# Altium schematic sheet ESQUEMATICOS PROYECTO 1 JAVIER MEDINA (PROGRA MICROS).SchDoc
size Letter; Organization: Altium Limited; Address1: L3, 12a Rodborough Rd; Address2: Frenchs Forest; Address3: NSW; Address4: Australia 2086; SPICEModelCacheNXRQJJJB: <root> / <DocumentId>NXRQJJJB</DocumentId> / <CacheFrame Number="0"> / <Model Name="2n3904" Kind="MDL"> / <Text>*2N3904 / *Si 310mW  40V 200mA 300MHz pkg:TO-92B 1,2,3 / .MODEL 2N3904 NPN(IS=1.4E-14 BF=300 VAF=100 IKF=0.025 ISE=3E-13 / + BR=7.5 RC=2.4 CJE=4.5E-12 TF=4E-10 CJC=3.5E-12 TR=2.1E-8 XTB=1.5 KF=9E-16 )</Text> / </Model> / </CacheFrame> / </root>
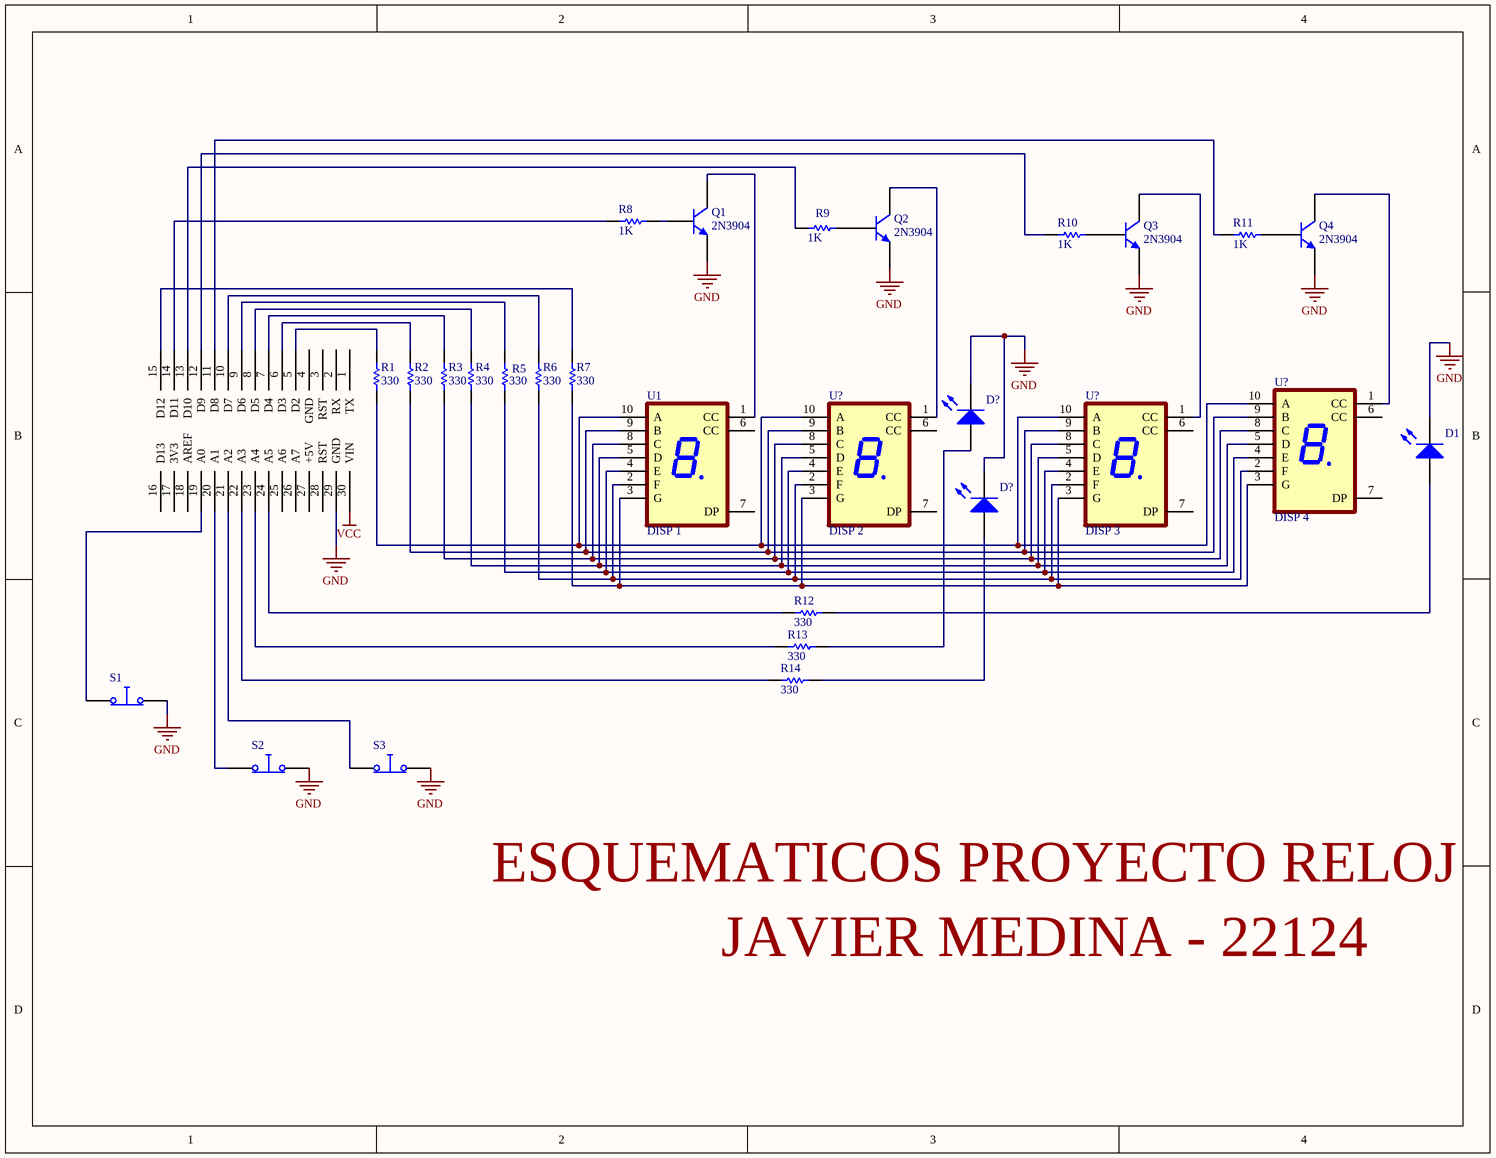
[diagram p0: ESQUEMATICOS PROYECTO 1 JAVIER MEDINA (PROGRA MICROS).SchDoc]

## Parts
(Parts that share a designator on the sheet are numbered #1, #2 ... from top to bottom, then left to right.)
?  (no value)  [PCBComponent_1]
D1  Light-Emitting Diode  (value not drawn)
D?#1  Light-Emitting Diode  (value not drawn)
D?#2  Light-Emitting Diode  (value not drawn)
Q1  2N3904  [TO-92A]
Q2  2N3904  [TO-92A]
Q3  2N3904  [TO-92A]
Q4  2N3904  [TO-92A]
R1  R1: 330  (hidden comment: Resistor)
R2  R1: 330  (hidden comment: Resistor)
R3  R1: 330  (hidden comment: Resistor)
R4  R1: 330  (hidden comment: Resistor)
R5  R1: 330  (hidden comment: Resistor)
R6  R1: 330  (hidden comment: Resistor)
R7  R1: 330  (hidden comment: Resistor)
R8  R1: 1K  (hidden comment: Resistor)
R9  R1: 1K  (hidden comment: Resistor)
R10  R1: 1K  (hidden comment: Resistor)
R11  R1: 1K  (hidden comment: Resistor)
R12  R1: 330  (hidden comment: Resistor)
R13  R1: 330  (hidden comment: Resistor)
R14  R1: 330  (hidden comment: Resistor)
S1  Push Button Normally Closed  (value not drawn)
S2  Push Button Normally Closed  (value not drawn)
S3  Push Button Normally Closed  (value not drawn)
U1  DISP 1  [DIPS762W50P254L1325H725Q10]
U?#1  DISP 4  [DIPS762W50P254L1325H725Q10]
U?#2  DISP 2  [DIPS762W50P254L1325H725Q10]
U?#3  DISP 3  [DIPS762W50P254L1325H725Q10]

## Nets
GND: ?.29(GND) D1.2(K) D?#1.2(K) D?#2.2(K) Q1.1(E) Q2.1(E) Q3.1(E) Q4.1(E) S1.2 S2.2 S3.2
VCC: ?.30(VIN)
Net?_5: ?.5(D2) R1.1
Net?_6: ?.6(D3) R2.1
Net?_7: ?.7(D4) R3.1
Net?_8: ?.8(D5) R4.1
Net?_9: ?.9(D6) R5.1
Net?_10: ?.10(D7) R6.1
Net?_11: ?.11(D8) R11.1
Net?_12: ?.12(D9) R10.1
Net?_13: ?.13(D10) R9.1
Net?_14: ?.14(D11) R8.1
Net?_15: ?.15(D12) R7.1
Net?_19: ?.19(A0) S1.1
Net?_20: ?.20(A1) S2.1
Net?_21: ?.21(A2) S3.1
Net?_22: ?.22(A3) R14.1
Net?_23: ?.23(A4) R13.1
Net?_24: ?.24(A5) R12.1
NetD1_1: D1.1(A) R12.2
NetD?#1_1: D?#1.1(A) R13.2
NetD?#2_1: D?#2.1(A) R14.2
NetQ1_2: Q1.2(B) R8.2
NetQ1_3: Q1.3(C) U1.1(CC)
NetQ2_2: Q2.2(B) R9.2
NetQ2_3: Q2.3(C) U?#2.1(CC)
NetQ3_2: Q3.2(B) R10.2
NetQ3_3: Q3.3(C) U?#3.1(CC)
NetQ4_2: Q4.2(B) R11.2
NetQ4_3: Q4.3(C) U?#1.1(CC)
NetR1_2: R1.2 U1.10(A) U?#1.10(A) U?#2.10(A) U?#3.10(A)
NetR2_2: R2.2 U1.9(B) U?#1.9(B) U?#2.9(B) U?#3.9(B)
NetR3_2: R3.2 U1.8(C) U?#1.8(C) U?#2.8(C) U?#3.8(C)
NetR4_2: R4.2 U1.5(D) U?#1.5(D) U?#2.5(D) U?#3.5(D)
NetR5_2: R5.2 U1.4(E) U?#1.4(E) U?#2.4(E) U?#3.4(E)
NetR6_2: R6.2 U1.2(F) U?#1.2(F) U?#2.2(F) U?#3.2(F)
NetR7_2: R7.2 U1.3(G) U?#1.3(G) U?#2.3(G) U?#3.3(G)

Not connected (* = marked no-connect by the designer): ? 1(TX) 2(RX) 3(RST) 4(GND) 16(D13) 17(3V3) 18(AREF) 25(A6) 26(A7) 27(+5V) 28(RST); U1 6(CC) 7(DP); U?#1 6(CC) 7(DP); U?#2 6(CC) 7(DP); U?#3 6(CC) 7(DP)

## Notes on the sheet
- ESQUEMATICOS PROYECTO RELOJ
- JAVIER MEDINA - 22124
- Proyecto:
- Autor:
- JAVIER MEDINA & MIGUEL DONIS
- Carnet:
- Documento:
- 22124 - 22993
- Curso:
- IE3028
- Fecha:
- Revisión:
- v1.0
- Tamaño:
- Carta
- Hoja:
- de

## Library data of the parts
? = Component_1
D1 D?#1 D?#2 = LED: AF: 1; BV: 0; BV_MAX: 1e99; EG: 1.11; FC: 0.5; IBV: 0.001; IS: 1e-14; MJSW: 0.33; NTUN: 30; TNOM: 27; XTI: 3; SimulationGenericComponent: True; CJO: 0; CJP: 0; CTA: 0; CTP: 0; FCS: 0.5; FV_MAX: 1e99; IKF: 0; IKR: 0; ISR: 1e-14; JSW: 0; JTUN: 0; JTUNSW: 0; KEG: 1; KF: 0; LEVEL: 1; N: 1; NBV: 1; NR: 1; NS: 1; PHP: 1; RS: 0; TCV: 0; TLEV: 0; TLEVC: 0; TM1: 0; TM2: 0; TPB: 0; TPHP: 0; TRS: 0; TRS2: 0; TT: 0; TTT1: 0; TTT2: 0; VJ: 1; XTITUN: 3
Q1-Q4 = 2N3904: NPN General Purpose Amplifier; Published: 8-Jun-2000; LatestRevisionDate: 15-Jan-2003; LatestRevisionNote: PCB Footprint 'BCY-W3/D4.7' replaced; DatasheetVersion: 1997; PackageVersion: Sep-1998; PackageReference: TO-92A; Publisher: Altium Limited; PackageDescription: TO, Flat Index; 3 In-Line, Axial Leads; Body Dia. 4.5mm; Leads 0.51 x 0.48 mm (max); ComponentLink1Description: Manufacturer Link; ComponentLink1URL: http://www.fairchildsemi.com/; ComponentLink2Description: Datasheet; ComponentLink2URL: http://www.fairchildsemi.com/ds/2N%2F2N3904.pdf
R1-R14 = Resistor: TC1: 0; SimulationGenericComponent: True; TC2: 0
S1-S3 = Push Button NC: closed: 1; Rclosed: 1m; Ropen: 1Meg; SimulationGenericComponent: True
U1 U?#1-U?#3 = SC39-12GWA: Green 9.9 mm White Diffused 6400 ucd 2.2 V Single Digit Numeric Display; Package: None; Price: None; Value: *; MP: SC39-12GWA; Availability: Unavailable